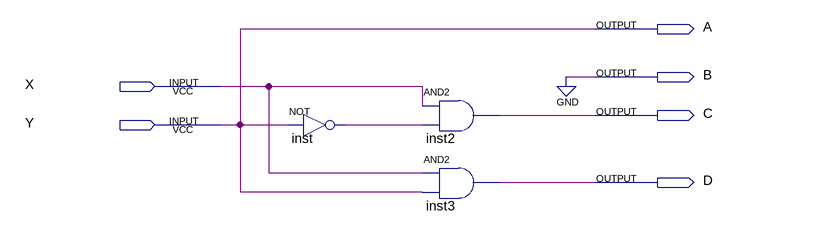
[diagram p0: schematic sheet]
// Quartus schematic step_3.bdf as structural Verilog: 3 symbols, 6 pins
module step_3 (
  input  X,
  input  Y,
  output A,
  output B,
  output C,
  output D
);

  wire inst_out;

  not inst (inst_out, Y);
  and inst2 (C, X, inst_out);
  and inst3 (D, X, Y);

  assign A = Y;
  assign B = 1'b0;
endmodule
